# Altium schematic sheet FRDM-MCXN947__Shield_Template.SchDoc
size B; Organization: Altium Limited; Address1: 3 Minna Close; Address2: Belrose; Address3: NSW 2085; Address4: Australia; SheetNumber: 1; SheetTotal: 3; PAGE_TITLE: -
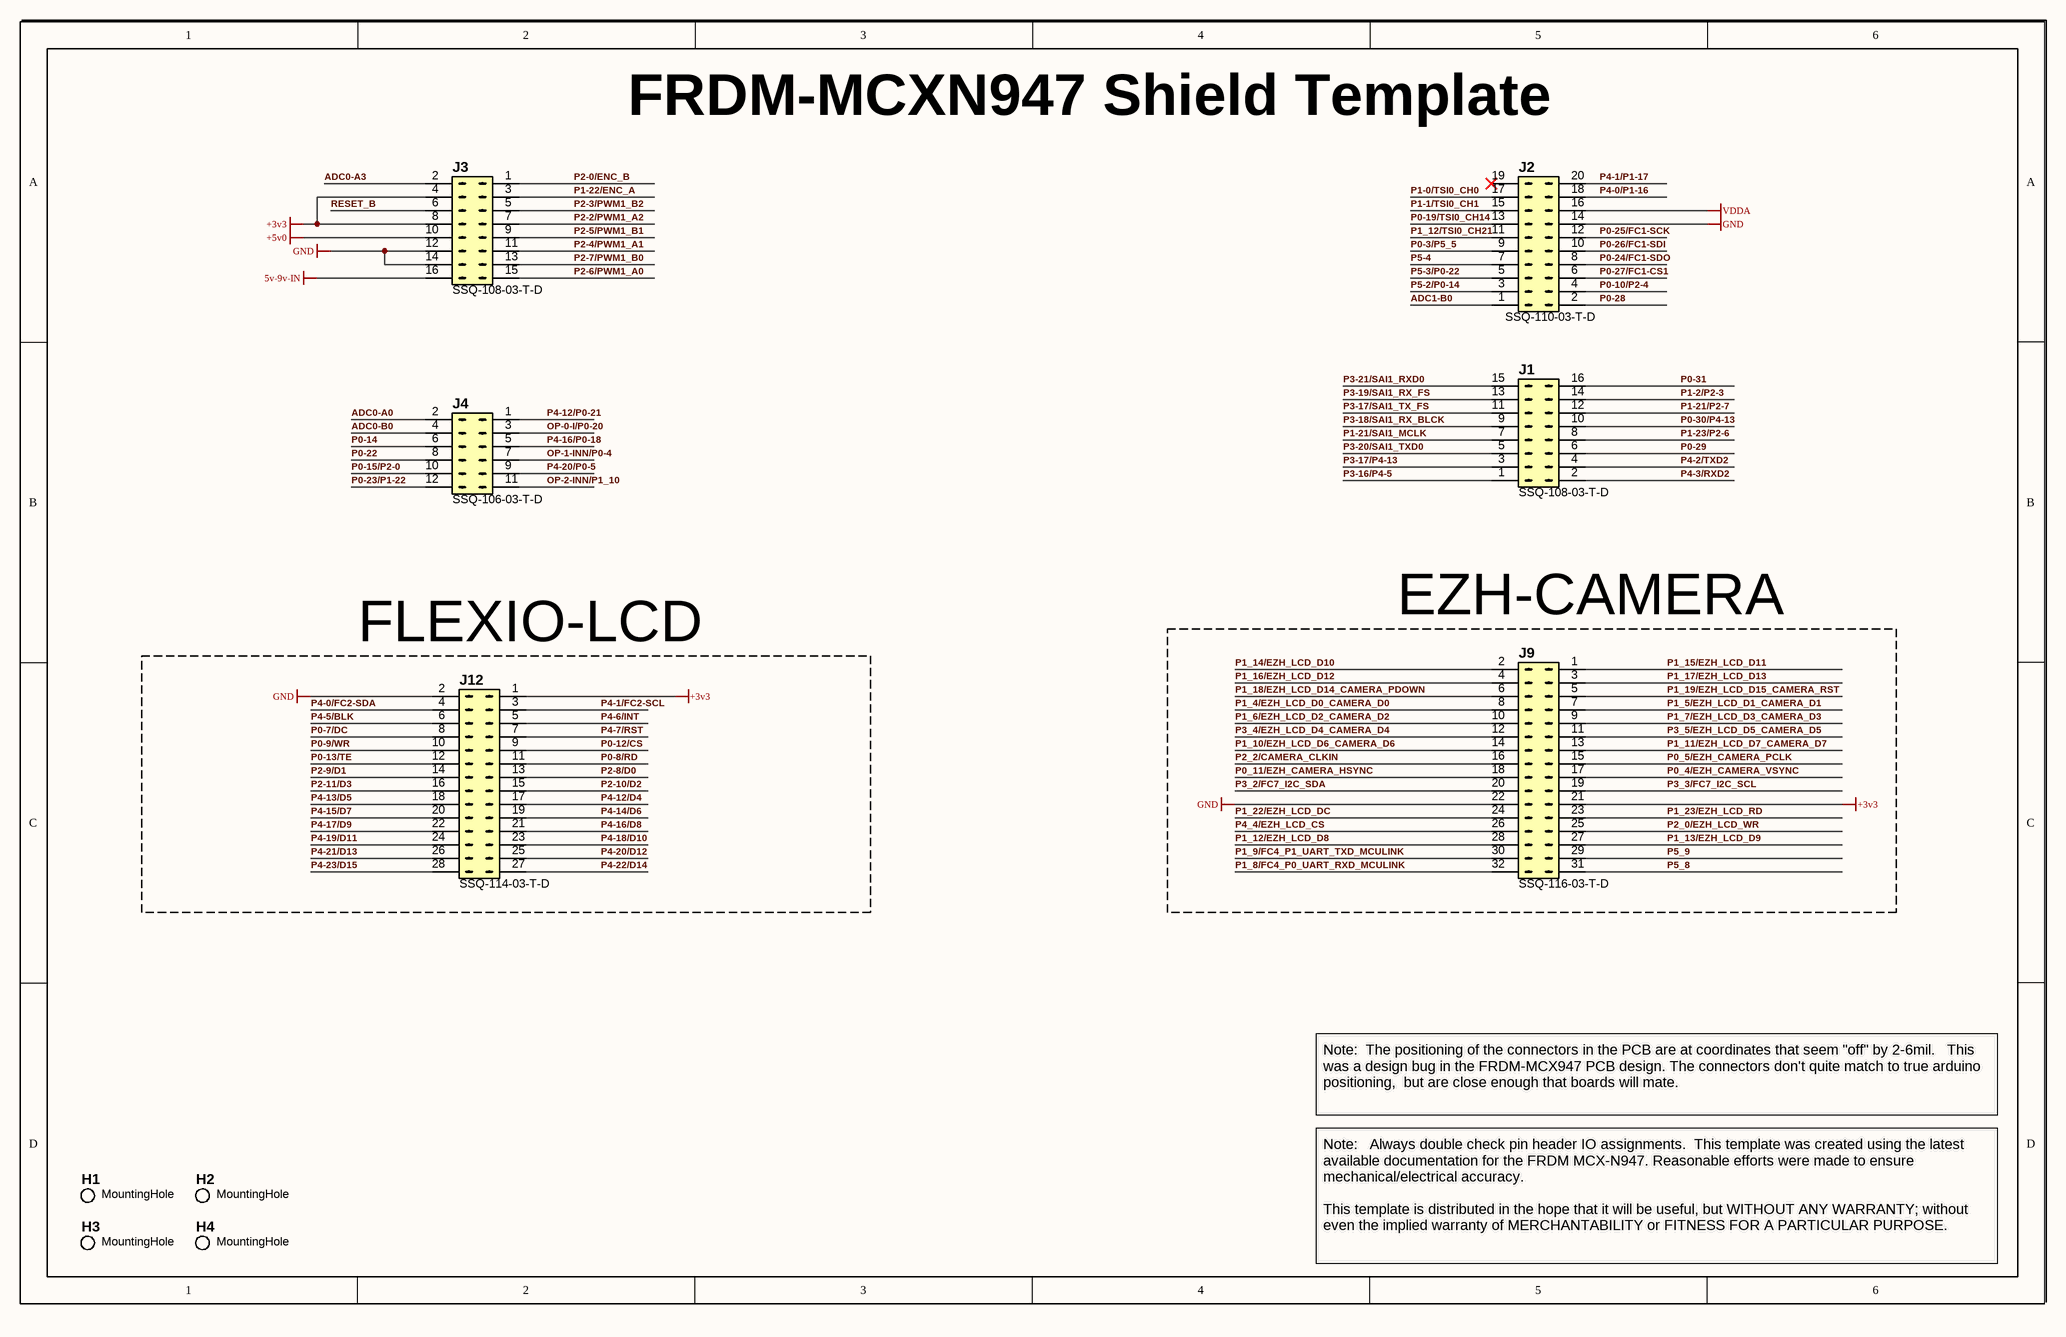
[diagram p0: FRDM-MCXN947__Shield_Template.SchDoc]

## Parts
H1  value MountingHole  [MountingHole_3.2mm_M3]  (hidden comment: Mechanical_MountingHole)
H2  value MountingHole  [MountingHole_3.2mm_M3]  (hidden comment: Mechanical_MountingHole)
H3  value MountingHole  [MountingHole_3.2mm_M3]  (hidden comment: Mechanical_MountingHole)
H4  value MountingHole  [MountingHole_3.2mm_M3]  (hidden comment: Mechanical_MountingHole)
J1  SSQ-108-03-T-D  [SSQ-108-03-T-D]
J2  SSQ-110-03-T-D  [SSQ-110-03-T-D]
J3  SSQ-108-03-T-D  [SSQ-108-03-T-D]
J4  SSQ-106-03-T-D  [SSQ-106-03-T-D]
J9  SSQ-116-03-T-D  [SSQ-116-03-T-D]
J12  SSQ-114-03-T-D  [SSQ-114-03-T-D]

## Blocks framed on the sheet
FLEXIO-LCD: J12
EZH-CAMERA: J9

## Nets
5v-9v-IN: J3.16(Pin_16)
+3v3: J3.4(Pin_4) J3.8(Pin_8) J9.21(Pin_21) J12.1(Pin_1)
+5v0: J3.10(Pin_10)
GND: J2.14(Pin_14) J3.12(Pin_12) J3.14(Pin_14) J9.22(Pin_22) J12.2(Pin_2)
VDDA: J2.16(Pin_16)
ADC0-A0: J4.2(Pin_2)
ADC0-A3: J3.2(Pin_2)
ADC0-B0: J4.4(Pin_4)
ADC1-B0: J2.1(Pin_1)
OP-0-I/P0-20: J4.3(Pin_3)
OP-1-INN/P0-4: J4.7(Pin_7)
OP-2-INN/P1_10: J4.11(Pin_11)
P0-3/P5_5: J2.9(Pin_9)
P0-7/DC: J12.8(Pin_8)
P0-8/RD: J12.11(Pin_11)
P0-9/WR: J12.10(Pin_10)
P0-10/P2-4: J2.4(Pin_4)
P0-12/CS: J12.9(Pin_9)
P0-13/TE: J12.12(Pin_12)
P0-14: J4.6(Pin_6)
P0-15/P2-0: J4.10(Pin_10)
P0-19/TSI0_CH14: J2.13(Pin_13)
P0-22: J4.8(Pin_8)
P0-23/P1-22: J4.12(Pin_12)
P0-24/FC1-SDO: J2.8(Pin_8)
P0-25/FC1-SCK: J2.12(Pin_12)
P0-26/FC1-SDI: J2.10(Pin_10)
P0-27/FC1-CS1: J2.6(Pin_6)
P0-28: J2.2(Pin_2)
P0-29: J1.6(Pin_6)
P0-30/P4-13: J1.10(Pin_10)
P0-31: J1.16(Pin_16)
P0_4/EZH_CAMERA_VSYNC: J9.17(Pin_17)
P0_5/EZH_CAMERA_PCLK: J9.15(Pin_15)
P0_11/EZH_CAMERA_HSYNC: J9.18(Pin_18)
P1-0/TSI0_CH0: J2.17(Pin_17)
P1-1/TSI0_CH1: J2.15(Pin_15)
P1-2/P2-3: J1.14(Pin_14)
P1-21/P2-7: J1.12(Pin_12)
P1-21/SAI1_MCLK: J1.7(Pin_7)
P1-22/ENC_A: J3.3(Pin_3)
P1-23/P2-6: J1.8(Pin_8)
P1_4/EZH_LCD_D0_CAMERA_D0: J9.8(Pin_8)
P1_5/EZH_LCD_D1_CAMERA_D1: J9.7(Pin_7)
P1_6/EZH_LCD_D2_CAMERA_D2: J9.10(Pin_10)
P1_7/EZH_LCD_D3_CAMERA_D3: J9.9(Pin_9)
P1_8/FC4_P0_UART_RXD_MCULINK: J9.32(Pin_32)
P1_9/FC4_P1_UART_TXD_MCULINK: J9.30(Pin_30)
P1_10/EZH_LCD_D6_CAMERA_D6: J9.14(Pin_14)
P1_11/EZH_LCD_D7_CAMERA_D7: J9.13(Pin_13)
P1_12/EZH_LCD_D8: J9.28(Pin_28)
P1_12/TSI0_CH21: J2.11(Pin_11)
P1_13/EZH_LCD_D9: J9.27(Pin_27)
P1_14/EZH_LCD_D10: J9.2(Pin_2)
P1_15/EZH_LCD_D11: J9.1(Pin_1)
P1_16/EZH_LCD_D12: J9.4(Pin_4)
P1_17/EZH_LCD_D13: J9.3(Pin_3)
P1_18/EZH_LCD_D14_CAMERA_PDOWN: J9.6(Pin_6)
P1_19/EZH_LCD_D15_CAMERA_RST: J9.5(Pin_5)
P1_22/EZH_LCD_DC: J9.24(Pin_24)
P1_23/EZH_LCD_RD: J9.23(Pin_23)
P2-0/ENC_B: J3.1(Pin_1)
P2-2/PWM1_A2: J3.7(Pin_7)
P2-3/PWM1_B2: J3.5(Pin_5)
P2-4/PWM1_A1: J3.11(Pin_11)
P2-5/PWM1_B1: J3.9(Pin_9)
P2-6/PWM1_A0: J3.15(Pin_15)
P2-7/PWM1_B0: J3.13(Pin_13)
P2-8/D0: J12.13(Pin_13)
P2-9/D1: J12.14(Pin_14)
P2-10/D2: J12.15(Pin_15)
P2-11/D3: J12.16(Pin_16)
P2_0/EZH_LCD_WR: J9.25(Pin_25)
P2_2/CAMERA_CLKIN: J9.16(Pin_16)
P3-16/P4-5: J1.1(Pin_1)
P3-17/P4-13: J1.3(Pin_3)
P3-17/SAI1_TX_FS: J1.11(Pin_11)
P3-18/SAI1_RX_BLCK: J1.9(Pin_9)
P3-19/SAI1_RX_FS: J1.13(Pin_13)
P3-20/SAI1_TXD0: J1.5(Pin_5)
P3-21/SAI1_RXD0: J1.15(Pin_15)
P3_2/FC7_I2C_SDA: J9.20(Pin_20)
P3_3/FC7_I2C_SCL: J9.19(Pin_19)
P3_4/EZH_LCD_D4_CAMERA_D4: J9.12(Pin_12)
P3_5/EZH_LCD_D5_CAMERA_D5: J9.11(Pin_11)
P4-0/FC2-SDA: J12.4(Pin_4)
P4-0/P1-16: J2.18(Pin_18)
P4-1/FC2-SCL: J12.3(Pin_3)
P4-1/P1-17: J2.20(Pin_20)
P4-2/TXD2: J1.4(Pin_4)
P4-3/RXD2: J1.2(Pin_2)
P4-5/BLK: J12.6(Pin_6)
P4-6/INT: J12.5(Pin_5)
P4-7/RST: J12.7(Pin_7)
P4-12/D4: J12.17(Pin_17)
P4-12/P0-21: J4.1(Pin_1)
P4-13/D5: J12.18(Pin_18)
P4-14/D6: J12.19(Pin_19)
P4-15/D7: J12.20(Pin_20)
P4-16/D8: J12.21(Pin_21)
P4-16/P0-18: J4.5(Pin_5)
P4-17/D9: J12.22(Pin_22)
P4-18/D10: J12.23(Pin_23)
P4-19/D11: J12.24(Pin_24)
P4-20/D12: J12.25(Pin_25)
P4-20/P0-5: J4.9(Pin_9)
P4-21/D13: J12.26(Pin_26)
P4-22/D14: J12.27(Pin_27)
P4-23/D15: J12.28(Pin_28)
P4_4/EZH_LCD_CS: J9.26(Pin_26)
P5-2/P0-14: J2.3(Pin_3)
P5-3/P0-22: J2.5(Pin_5)
P5-4: J2.7(Pin_7)
P5_8: J9.31(Pin_31)
P5_9: J9.29(Pin_29)
RESET_B: J3.6(Pin_6)

Not connected (* = marked no-connect by the designer): J2 19(Pin_19)*

## Notes on the sheet
- FRDM-MCXN947 Shield Template
- Note:  The positioning of the connectors in the PCB are at coordinates that seem "off" by 2-6mil.   This was a design bug in the FRDM-MCX947 PCB design. The connectors don't quite match to true arduino positioning,  but are close enough that boards will mate.
- Note:   Always double check pin header IO assignments.  This template was created using the latest available documentation for the FRDM MCX-N947. Reasonable efforts were made to ensure mechanical/electrical accuracy.
  This template is distributed in the hope that it will be useful, but WITHOUT ANY WARRANTY; without even the implied warranty of MERCHANTABILITY or FITNESS FOR A PARTICULAR PURPOSE.

## Library data of the parts
H1-H4 = Mechanical_MountingHole: Add into BOM: yes; Name: Mechanical_MountingHole; Symbol: Mechanical_MountingHole; Device: Mechanical_MountingHole; User doc link: ~; Convert to PCB: yes; Origin Footprint: MountingHole_3.2mm_M3
J1 J3 = SSQ-108-03-T-D: Manufacturer: Samtec Inc.; Value: SSQ-108-03-T-D; Manufacturer Part Number: SSQ-108-03-T-D
J2 = SSQ-110-03-T-D: Manufacturer: Samtec Inc.; Manufacturer Part Number: SSQ-110-23-T-D; Value: SSQ-110-03-T-D
J4 = SSQ-106-03-T-D: Manufacturer: Samtec Inc.; Manufacturer Part Number: SSQ-106-03-T-D; Value: SSQ-106-03-T-D
J9 = SSQ-116-03-T-D: Manufacturer: Samtec Inc.; Value: SSQ-116-03-T-D; Manufacturer P/N: SSQ-116-03-T-D
J12 = SSQ-114-03-T-D: Manufacturer: Samtec Inc.; Value: SSQ-114-03-T-D; Manufacturer Part Number: SSQ-114-03-T-D